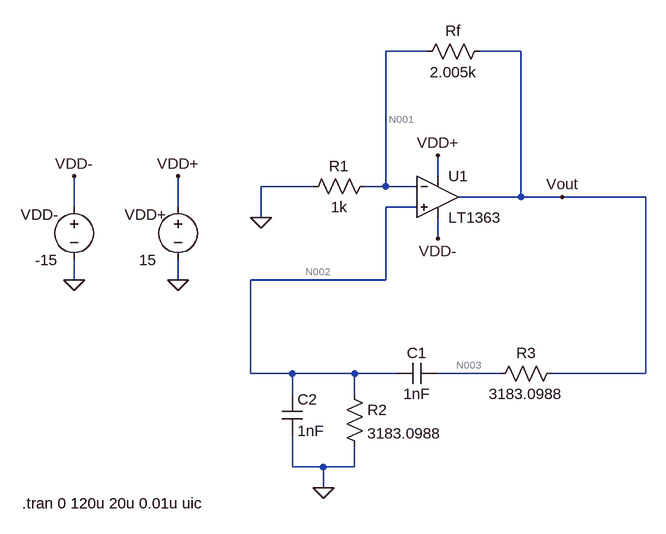
[diagram p0: schematic q2.asc]
q2.asc, the LTspice schematic file:
Version 4.1
SHEET 1 880 1044
WIRE 176 -64 112 -64
WIRE 320 -64 256 -64
WIRE 192 128 192 96
WIRE 0 144 -80 144
WIRE 112 144 112 -64
WIRE 112 144 80 144
WIRE 160 144 112 144
WIRE 320 160 320 -64
WIRE 320 160 224 160
WIRE 384 160 320 160
WIRE 512 160 384 160
WIRE -368 176 -368 128
WIRE -208 176 -208 128
WIRE 160 176 112 176
WIRE -80 192 -80 144
WIRE 192 224 192 192
WIRE -368 288 -368 256
WIRE -208 288 -208 256
WIRE 112 288 112 176
WIRE 112 288 -96 288
WIRE -96 432 -96 288
WIRE -32 432 -96 432
WIRE 64 432 -32 432
WIRE 128 432 64 432
WIRE 288 432 192 432
WIRE 512 432 512 160
WIRE 512 432 368 432
WIRE -32 464 -32 432
WIRE 64 464 64 432
WIRE -32 576 -32 528
WIRE 16 576 -32 576
WIRE 64 576 64 544
WIRE 64 576 16 576
WIRE 16 608 16 576
FLAG -368 288 0
FLAG 384 160 Vout
FLAG -208 288 0
FLAG -368 128 VDD-
FLAG -208 128 VDD+
FLAG 192 96 VDD+
FLAG 192 224 VDD-
FLAG 16 608 0
FLAG -80 192 0
SYMBOL voltage -368 160 R0
WINDOW 0 -82 27 Left 2
WINDOW 3 -60 97 Left 2
WINDOW 123 0 0 Left 0
WINDOW 39 0 0 Left 0
SYMATTR InstName VDD-
SYMATTR Value -15
SYMBOL voltage -208 160 R0
WINDOW 0 -82 27 Left 2
WINDOW 3 -60 97 Left 2
WINDOW 123 0 0 Left 0
WINDOW 39 0 0 Left 0
SYMATTR InstName VDD+
SYMATTR Value 15
SYMBOL cap -48 464 R0
SYMATTR InstName C2
SYMATTR Value 1nF
SYMBOL res 272 -80 R90
WINDOW 0 0 56 VBottom 2
WINDOW 3 32 56 VTop 2
SYMATTR InstName Rf
SYMATTR Value 2.005k
SYMBOL res 96 128 R90
WINDOW 0 0 56 VBottom 2
WINDOW 3 32 56 VTop 2
SYMATTR InstName R1
SYMATTR Value 1k
SYMBOL OpAmps\\LT1363 192 96 R0
SYMATTR InstName U1
SYMBOL res 48 448 R0
SYMATTR InstName R2
SYMATTR Value 3183.0988
SYMBOL cap 192 416 R90
WINDOW 0 0 32 VBottom 2
WINDOW 3 32 32 VTop 2
SYMATTR InstName C1
SYMATTR Value 1nF
SYMBOL res 384 416 R90
WINDOW 0 0 56 VBottom 2
WINDOW 3 32 56 VTop 2
SYMATTR InstName R3
SYMATTR Value 3183.0988
TEXT -448 632 Left 2 !.tran 0 120u 20u 0.01u uic

The netlist it stands for:
* q2.asc
VDD- VDD- 0 -15
VDD+ VDD+ 0 15
C2 N002 0 1nF
Rf Vout N001 2.005k
R1 N001 0 1k
X§U1 N002 N001 VDD+ VDD- Vout LT1363  ; pins In+ In- V+ V- OUT
R2 N002 0 3183.0988
C1 N003 N002 1nF
R3 Vout N003 3183.0988
.tran 0 120u 20u 0.01u uic
.lib LT1363.sub
.backanno
.end

* Results of the author's LTspice run, read from the files saved beside the schematic
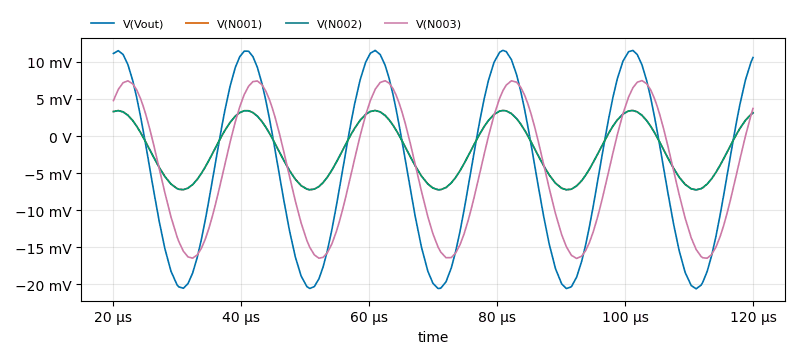
[diagram p1: Transient Analysis of q2.asc, plotted from the saved traces]
* Transient Analysis, 1 run:
*   V(Vout): min -20.64 mV, max 11.57 mV, average -4.588 mV, rms 12.24 mV, last 10.6 mV
*   V(N001): min -7.268 mV, max 3.449 mV, average -1.927 mV, rms 4.239 mV, last 3.126 mV
*   V(N002): min -7.276 mV, max 3.447 mV, average -1.933 mV, rms 4.243 mV, last 3.129 mV
*   V(N003): min -16.54 mV, max 7.486 mV, average -4.563 mV, rms 9.639 mV, last 3.721 mV